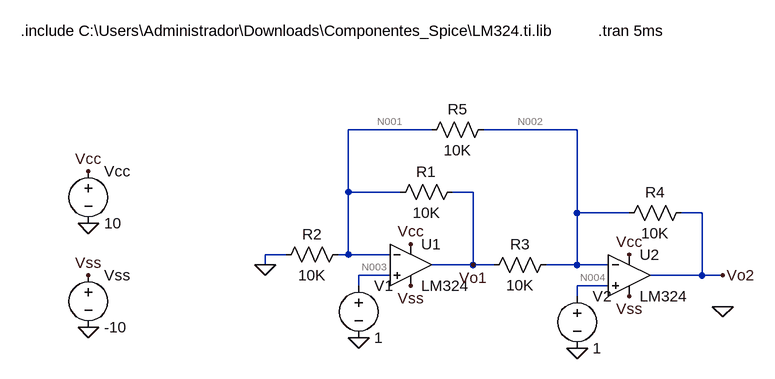
[diagram p0: schematic Diferencial.asc]
Diferencial.asc, the LTspice schematic file:
Version 4
SHEET 1 880 680
WIRE 112 -48 -16 -48
WIRE 336 -48 192 -48
WIRE -16 48 -16 -48
WIRE 64 48 -16 48
WIRE 176 48 144 48
WIRE 336 80 336 -48
WIRE 416 80 336 80
WIRE 528 80 496 80
WIRE -112 144 -144 144
WIRE -16 144 -16 48
WIRE -16 144 -32 144
WIRE 48 144 -16 144
WIRE -144 160 -144 144
WIRE 176 160 176 48
WIRE 176 160 112 160
WIRE 208 160 176 160
WIRE 336 160 336 80
WIRE 336 160 288 160
WIRE 384 160 336 160
WIRE 48 176 0 176
WIRE 528 176 528 80
WIRE 528 176 448 176
WIRE 560 176 528 176
WIRE 0 192 0 176
WIRE 384 192 336 192
WIRE 336 208 336 192
FLAG -144 160 0
FLAG 560 176 Vo2
FLAG 560 224 0
FLAG 336 288 0
FLAG 0 272 0
FLAG -416 96 0
FLAG -416 256 0
FLAG 80 128 Vcc
FLAG 416 144 Vcc
FLAG -416 16 Vcc
FLAG -416 176 Vss
FLAG 80 192 Vss
FLAG 416 208 Vss
FLAG 176 160 Vo1
SYMBOL OpAmps\\opamp2 80 96 R0
SYMATTR InstName U1
SYMATTR Value LM324
SYMBOL OpAmps\\opamp2 416 112 R0
SYMATTR InstName U2
SYMATTR Value LM324
SYMBOL res -16 128 R90
WINDOW 0 0 56 VBottom 2
WINDOW 3 32 56 VTop 2
SYMATTR InstName R2
SYMATTR Value 10K
SYMATTR SpiceLine tol=1 pwr=0.1
SYMBOL res 208 -64 R90
WINDOW 0 0 56 VBottom 2
WINDOW 3 32 56 VTop 2
SYMATTR InstName R5
SYMATTR Value 10K
SYMATTR SpiceLine tol=1 pwr=0.1
SYMBOL voltage 0 176 R0
WINDOW 123 0 0 Left 0
WINDOW 39 0 0 Left 0
SYMATTR InstName V1
SYMATTR Value 1
SYMBOL voltage 336 192 R0
WINDOW 123 0 0 Left 0
WINDOW 39 0 0 Left 0
SYMATTR InstName V2
SYMATTR Value 1
SYMBOL voltage -416 0 R0
WINDOW 123 0 0 Left 0
WINDOW 39 0 0 Left 0
SYMATTR InstName Vcc
SYMATTR Value 10
SYMBOL voltage -416 160 R0
WINDOW 123 0 0 Left 0
WINDOW 39 0 0 Left 0
SYMATTR InstName Vss
SYMATTR Value -10
SYMBOL res 160 32 R90
WINDOW 0 0 56 VBottom 2
WINDOW 3 32 56 VTop 2
SYMATTR InstName R1
SYMATTR Value 10K
SYMATTR SpiceLine tol=1 pwr=0.1
SYMBOL res 304 144 R90
WINDOW 0 0 56 VBottom 2
WINDOW 3 32 56 VTop 2
SYMATTR InstName R3
SYMATTR Value 10K
SYMATTR SpiceLine tol=1 pwr=0.1
SYMBOL res 512 64 R90
WINDOW 0 0 56 VBottom 2
WINDOW 3 32 56 VTop 2
SYMATTR InstName R4
SYMATTR Value 10K
SYMATTR SpiceLine tol=1 pwr=0.1
TEXT -520 -200 Left 2 !.include C:\\Users\\Administrador\\Downloads\\Componentes_Spice\\LM324.ti.lib
TEXT 368 -200 Left 2 !.tran 5ms

The netlist it stands for:
* Diferencial.asc
XU1 N003 N001 Vcc Vss Vo1 LM324  ; pins In+ In- V+ V- OUT
XU2 N004 N002 Vcc Vss Vo2 LM324  ; pins In+ In- V+ V- OUT
R2 N001 0 10K tol=1 pwr=0.1
R5 N002 N001 10K tol=1 pwr=0.1
V1 N003 0 1
V2 N004 0 1
Vcc Vcc 0 10
Vss Vss 0 -10
R1 Vo1 N001 10K tol=1 pwr=0.1
R3 N002 Vo1 10K tol=1 pwr=0.1
R4 Vo2 N002 10K tol=1 pwr=0.1
.include C:\Users\Administrador\Downloads\Componentes_Spice\LM324.ti.lib
.tran 5ms
.backanno
.end

* Results of the author's LTspice run, read from the files saved beside the schematic
* Operating Point, zero values left out:
*   V(vo1) = 2 V
*   V(vss) = -10 V
*   V(vcc) = 10 V
*   V(n001) = 999.9 mV
*   V(n003) = 1 V
*   V(vo2) = 81.84 µV
*   V(n002) = 999.9 mV
*   V(n004) = 1 V
*   I(R2) = 99.99 µA
*   I(R5) = 2.045 nA
*   I(R1) = 99.97 µA
*   I(R3) = -99.96 µA
*   I(R4) = -99.98 µA
*   I(V1) = 19.8 nA
*   I(V2) = 19.81 nA
*   I(Vcc) = -1.34 mA
*   I(Vss) = 1.34 mA
*   Ix(u1:1) = -19.8 nA
*   Ix(u1:2) = -19.86 nA
*   Ix(u1:3) = 669.9 µA
*   Ix(u1:4) = -669.8 µA
*   Ix(u1:5) = -199.9 µA
*   Ix(u2:1) = -19.81 nA
*   Ix(u2:2) = -19.85 nA
*   Ix(u2:3) = 669.9 µA
*   Ix(u2:4) = -669.8 µA
*   Ix(u2:5) = 99.98 µA